# Altium schematic sheet ALARM.SchDoc: Alarm and sound
size B; Author: Sebastien Gelinas; CompanyName: SmartHalo; Organization: SmartHalo; Address1: 5445 de Gaspé; Address2: Montréal, QC; Address3: Canada; Address4: H2T 3B2; Revision: 1; SheetNumber: 5; SheetTotal: 5
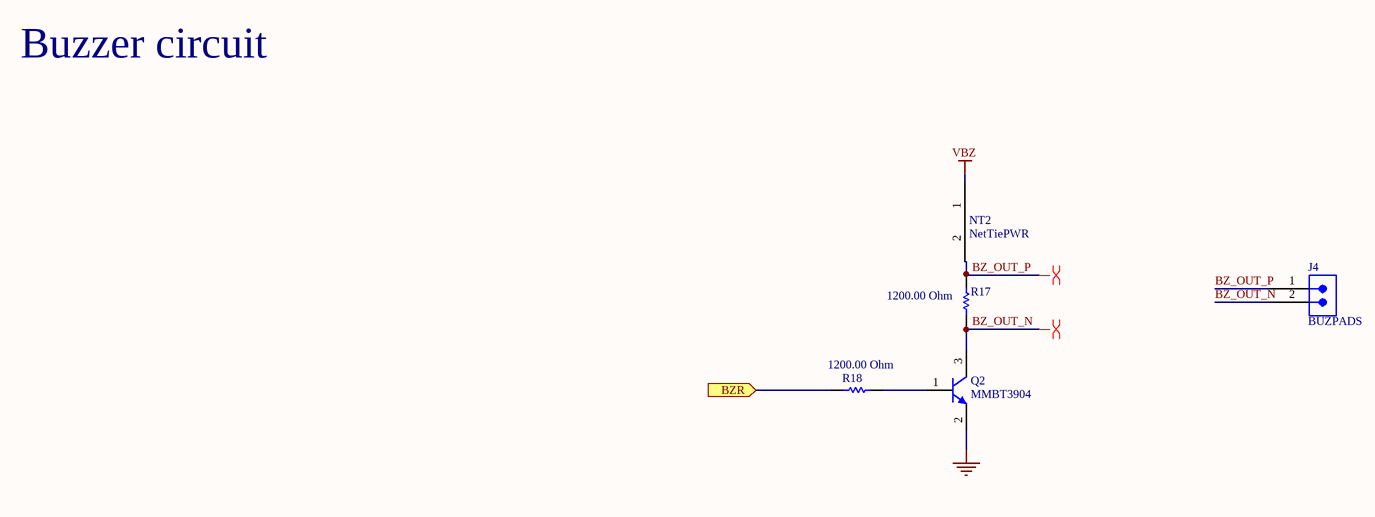
[diagram p0: ALARM.SchDoc]

## Parts
J4  BUZPADS  [BUZZERPADS]
NT2  NetTiePWR  [NetTiePWR]  (net tie, no BOM)
Q2  MMBT3904  [INF-SOT23_L]
R17  value 1200.00 Ohm  [RESC0402(1005)_N]  (hidden comment: 1K2 5% 0402(1005))
R18  value 1200.00 Ohm  [RESC0402(1005)_N]  (hidden comment: 1K2 5% 0402(1005))

## Ports
BZR

## Nets
GND: Q2.2(E)
VBZ: NT2.1(NET1)
BZ_OUT_N: J4.2 Q2.3(C) R17.1
BZ_OUT_P: J4.1 NT2.2(NET2) R17.2
BZR: R18.1 ; port BZR
NetQ2_1: Q2.1(B) R18.2

## Layout directives
differential pair: BZ_OUT_N, BZ_OUT_P

## Notes on the sheet
- Buzzer circuit
- Title
- Size:
- Date:
- B
- Author:
- Time:
- Sheet
- Revision:
- of
- File:

## Library data of the parts
J4 = BUZPADS: Buzzer Pogo Pins, Sizes and Pitch TBD
Q2 = CMP-1178-00008-1: NPN Silicon Switching Transistor, 40 V VCEO, 200 mA IC, SOT23, Reel, Green; Manufacturer: Infineon; IC (max): 200 mA; VCBO (max): 60 V; VCE (max): 1 V; Green: TRUE; ICBO (max): 50 nA; IC: 10 mA; VCEO (max): 40 V; VEBO (max): 6 V; ComponentLink3Description: Package Specification; ComponentLink2Description: Datasheet; PackageDescription: 3-Pin Small Outline Transistor Package, 1.3 x 2.9 mm Body, 0.95 mm Pitch; Packing: Reel; ComponentLink1Description: Manufacturer URL; Polarity: NPN; ComponentLink3URL: http://www.infineon.com/dgdl/SOT23-Package_Overview.pdf?folderId=db3a30431936bc4b0119532290053c66&fileId=db3a30431936bc4b0119533468123c85; PackageReference: SOT23; Mounting Technology: Surface Mount; VCE: 1 V; ComponentLink2URL: http://www.infineon.com/dgdl/smbt3904series_mmbt3904.pdf?folderId=db3a30431441fb5d011445fab851018e&fileId=db3a30431441fb5d0114460005c10191; PartNumber: MMBT3904; PackageVersion: Apr-08; ComponentLink1URL: http://www.infineon.com/
R17 R18 = CMP-1011-00076-1: 1K2 0.063W 5% 0402 (1005 Metric)  SMD; Case-Metric: 1005; Case-EIA: 0402; Power: 0.063 W; Tolerance: 5 %; Technology: SMT